# EAGLE design untitled (EAGLE 8.2.1)
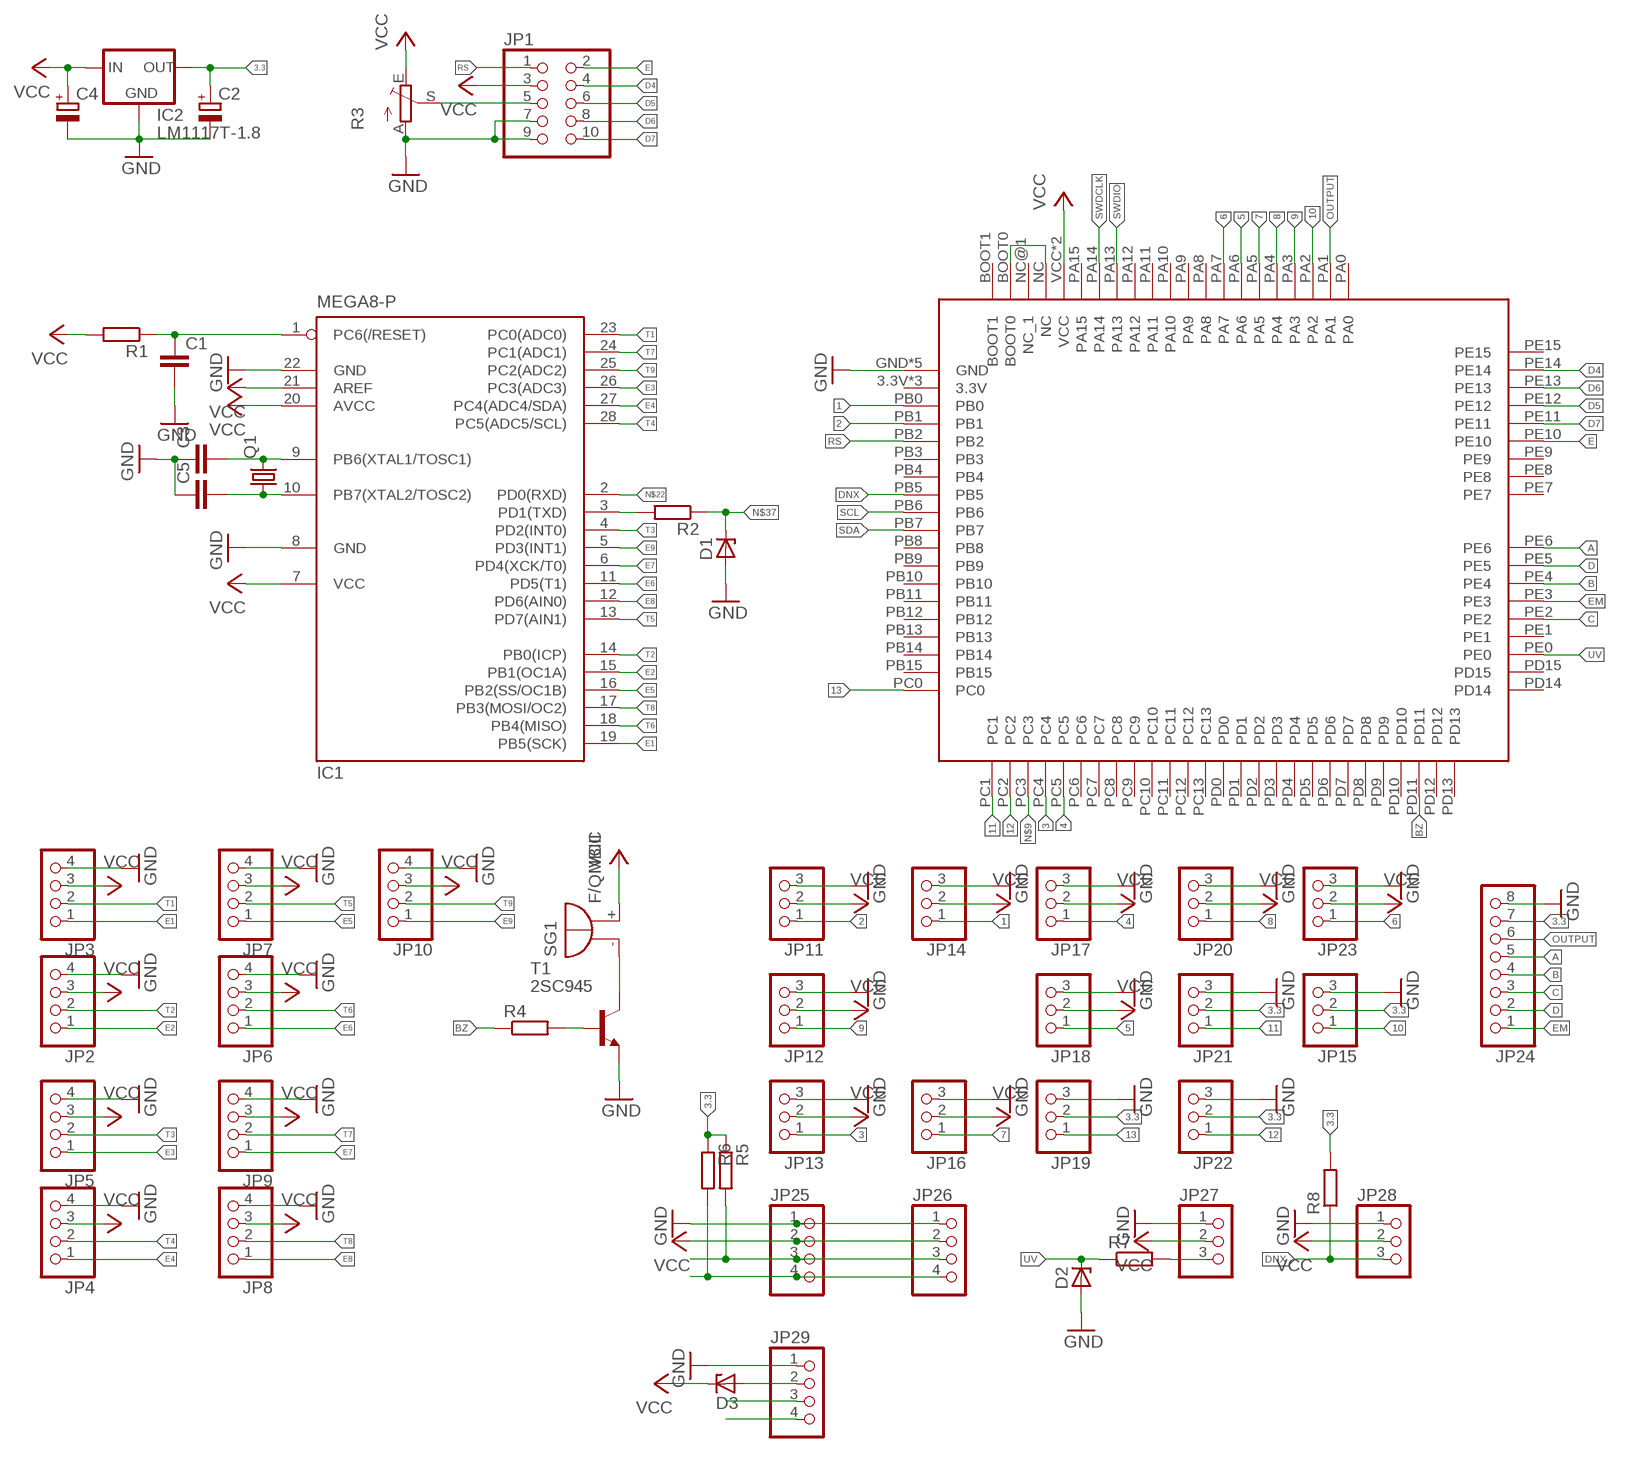
[diagram p0: schematic, sheet 1]

## Parts
C1  C-EU025-025X050  [C025-025X050]
C2  CPOL-EUE2.5-5  [E2,5-5]
C3  C-EU025-025X050  [C025-025X050]
C4  CPOL-EUE2.5-5  [E2,5-5]
C5  C-EU025-025X050  [C025-025X050]
D1  ZENER-DIODEDO34-7  [DO34Z7]
D2  ZENER-DIODEDO34-7  [DO34Z7]
D3  ZENER-DIODEDO34-7  [DO34Z7]
IC1  MEGA8-P  [DIL28-3]
IC2  LM1117T-1.8  [TO220]
JP1  PINHD-2X5  [2X05]
JP2  PINHD-1X4  [1X04]
JP3  PINHD-1X4  [1X04]
JP4  PINHD-1X4  [1X04]
JP5  PINHD-1X4  [1X04]
JP6  PINHD-1X4  [1X04]
JP7  PINHD-1X4  [1X04]
JP8  PINHD-1X4  [1X04]
JP9  PINHD-1X4  [1X04]
JP10  PINHD-1X4  [1X04]
JP11  PINHD-1X3  [1X03]
JP12  PINHD-1X3  [1X03]
JP13  PINHD-1X3  [1X03]
JP14  PINHD-1X3  [1X03]
JP15  PINHD-1X3  [1X03]
JP16  PINHD-1X3  [1X03]
JP17  PINHD-1X3  [1X03]
JP18  PINHD-1X3  [1X03]
JP19  PINHD-1X3  [1X03]
JP20  PINHD-1X3  [1X03]
JP21  PINHD-1X3  [1X03]
JP22  PINHD-1X3  [1X03]
JP23  PINHD-1X3  [1X03]
JP24  PINHD-1X8  [1X08]
JP25  PINHD-1X4  [1X04]
JP26  PINHD-1X4  [1X04]
JP27  PINHD-1X3  [1X03]
JP28  PINHD-1X3  [1X03]
JP29  PINHD-1X4  [1X04]
Q1  CRYSTALHC49U70  [HC49U70]
R1  R-EU_0204/7  [0204/7]
R2  R-EU_0204/7  [0204/7]
R3  TRIM_EU-CA6V  [CA6V]
R4  R-EU_0204/7  [0204/7]
R5  R-EU_0204/7  [0204/7]
R6  R-EU_0204/7  [0204/7]
R7  R-EU_0204/7  [0204/7]
R8  R-EU_0204/7  [0204/7]
SG1  F/QMBIII  [F/QMBIII]
T1  2SC945  [TO92-ECB]
U$1  STM32F4  [STM32F4]

## Nets
1: JP14.1 U$1.PB0
2: JP11.1 U$1.PB1
3: JP13.1 U$1.PC4
3.3: C2.+ IC2.2(OUT) JP15.2 JP19.2 JP21.2 JP22.2 JP24.7 R5.1 R6.1 R8.2
4: JP17.1 U$1.PC5
5: JP18.1 U$1.PA6
6: JP23.1 U$1.PA7
7: JP16.1 U$1.PA5
8: JP20.1 U$1.PA4
9: JP12.1 U$1.PA3
10: JP15.1 U$1.PA2
11: JP21.1 U$1.PC1
12: JP22.1 U$1.PC2
13: JP19.1 U$1.PC0
A: JP24.5 U$1.PE6
B: JP24.4 U$1.PE4
BZ: R4.1 U$1.PD11
C: JP24.3 U$1.PE2
D: JP24.2 U$1.PE5
D4: JP1.4 U$1.PE14
D5: JP1.6 U$1.PE12
D6: JP1.8 U$1.PE13
D7: JP1.10 U$1.PE11
DNX: JP28.3 R8.1 U$1.PB5
E: JP1.2 U$1.PE10
E1: IC1.19(PB5(SCK)) JP3.1
E2: IC1.15(PB1(OC1A)) JP2.1
E3: IC1.26(PC3(ADC3)) JP5.1
E4: IC1.27(PC4(ADC4/SDA)) JP4.1
E5: IC1.16(PB2(SS/OC1B)) JP7.1
E6: IC1.11(PD5(T1)) JP6.1
E7: IC1.6(PD4(XCK/T0)) JP9.1
E8: IC1.12(PD6(AIN0)) JP8.1
E9: IC1.5(PD3(INT1)) JP10.1
EM: JP24.1 U$1.PE3
GND: C1.2 C2.- C3.1 C4.- C5.1 D1.A D2.A IC1.8(GND) IC1.22(GND) IC2.1(GND) JP1.7 JP1.9 JP2.4 JP3.4 JP4.4 JP5.4 JP6.4 JP7.4 JP8.4 JP9.4 JP10.4 JP11.3 JP12.3 JP13.3 JP14.3 JP15.3 JP16.3 JP17.3 JP18.3 JP19.3 JP20.3 JP21.3 JP22.3 JP23.3 JP24.8 JP25.1 JP26.1 JP27.1 JP28.1 JP29.1 R3.A T1.E U$1.GND U$1.GND@1(GND) U$1.GND@2(GND) U$1.GND@3(GND) U$1.GND@5(GND)
N$1: C1.1 IC1.1(PC6(/RESET)) R1.1
N$2: D3.A JP29.2
N$3: C5.2 IC1.10(PB7(XTAL2/TOSC2)) Q1.1
N$4: C3.2 IC1.9(PB6(XTAL1/TOSC1)) Q1.2
N$6: JP27.3 R7.2
N$7: JP1.5 R3.S
N$9: U$1.PC3
N$15: U$1.BOOT0 U$1.NC
N$16: SG1.-(+) T1.C
N$17: R4.2 T1.B
N$22: IC1.2(PD0(RXD))
N$23: IC1.3(PD1(TXD)) R2.2
N$37: D1.C R2.1
OUTPUT: JP24.6 U$1.PA1
RS: JP1.1 U$1.PB2
SCL: JP25.4 JP26.4 R6.2 U$1.PB6
SDA: JP25.3 JP26.3 R5.2 U$1.PB7
SWDCLK: JP29.3 U$1.PA14
SWDIO: JP29.4 U$1.PA13
T1: IC1.23(PC0(ADC0)) JP3.2
T2: IC1.14(PB0(ICP)) JP2.2
T3: IC1.4(PD2(INT0)) JP5.2
T4: IC1.28(PC5(ADC5/SCL)) JP4.2
T5: IC1.13(PD7(AIN1)) JP7.2
T6: IC1.18(PB4(MISO)) JP6.2
T7: IC1.24(PC1(ADC1)) JP9.2
T8: IC1.17(PB3(MOSI/OC2)) JP8.2
T9: IC1.25(PC2(ADC2)) JP10.2
UV: D2.C R7.1 U$1.PE0
VCC: C4.+ D3.C IC1.7(VCC) IC1.20(AVCC) IC1.21(AREF) IC2.3(IN) JP1.3 JP2.3 JP3.3 JP4.3 JP5.3 JP6.3 JP7.3 JP8.3 JP9.3 JP10.3 JP11.2 JP12.2 JP13.2 JP14.2 JP16.2 JP17.2 JP18.2 JP20.2 JP23.2 JP25.2 JP26.2 JP27.2 JP28.2 R1.2 R3.E SG1.+(-) U$1.VCC U$1.VCC@1(VCC)
Unconnected: U$1.3.3V U$1.3.3V@2(3.3V) U$1.3.3V@3(3.3V) U$1.BOOT1 U$1.NC@1(NC_1) U$1.PA0 U$1.PA8 U$1.PA9 U$1.PA10 U$1.PA11 U$1.PA12 U$1.PA15 U$1.PB3 U$1.PB4 U$1.PB8 U$1.PB9 U$1.PB10 U$1.PB11 U$1.PB12 U$1.PB13 U$1.PB14 U$1.PB15 U$1.PC6 U$1.PC7 U$1.PC8 U$1.PC9 U$1.PC10 U$1.PC11 U$1.PC12 U$1.PC13 U$1.PD0 U$1.PD1 U$1.PD2 U$1.PD3 U$1.PD4 U$1.PD5 U$1.PD6 U$1.PD7 U$1.PD8 U$1.PD9 U$1.PD10 U$1.PD12 U$1.PD13 U$1.PD14 U$1.PD15 U$1.PE1 U$1.PE7 U$1.PE8 U$1.PE9 U$1.PE15

## Library data of the parts
C1 C3 C5 = rcl:C-EU: CAPACITOR, European symbol
C2 C4 = rcl:CPOL-EU: POLARIZED CAPACITOR, European symbol
D1-D3 = diode:ZENER-DIODE: Z-Diode
IC1 = atmel:MEGA8-P: MICROCONTROLLER 8 Kbytes FLASH, 1 kbytes SRAM, 512 bytes EEPROM, USART, 4-channel 10 bit ADC, 2-channel 8 bit ADC Pin compatible with Atmega48, ATMega88, ATMega168 Source: avr.lbr; OC_FARNELL: unknown; OC_NEWARK: unknown
IC2 = lm1117:LM1117T-*
JP1 = pinhead:PINHD-2X5: PIN HEADER
JP2-JP10 JP25 JP26 JP29 = pinhead:PINHD-1X4: PIN HEADER
JP11-JP23 JP27 JP28 = pinhead:PINHD-1X3: PIN HEADER
JP24 = pinhead:PINHD-1X8: PIN HEADER
Q1 = crystal:CRYSTAL: CRYSTAL; OC_FARNELL: unknown; OC_NEWARK: unknown
R1 R2 R4-R8 = rcl:R-EU_: RESISTOR, European symbol
R3 = pot:TRIM_EU-: POTENTIOMETER
SG1 = buzzer:F/QMBIII: BUZZER Source: Buerklin; OC_FARNELL: unknown; OC_NEWARK: unknown
T1 = transistor:2SC945: NPN Silicon Epitaxial Planar Transistor Source: SEMTECH ELECTRONICS LTD. ... 2SC945 2.pdf
U$1 = STM32F407-2:STM32F4

## Board
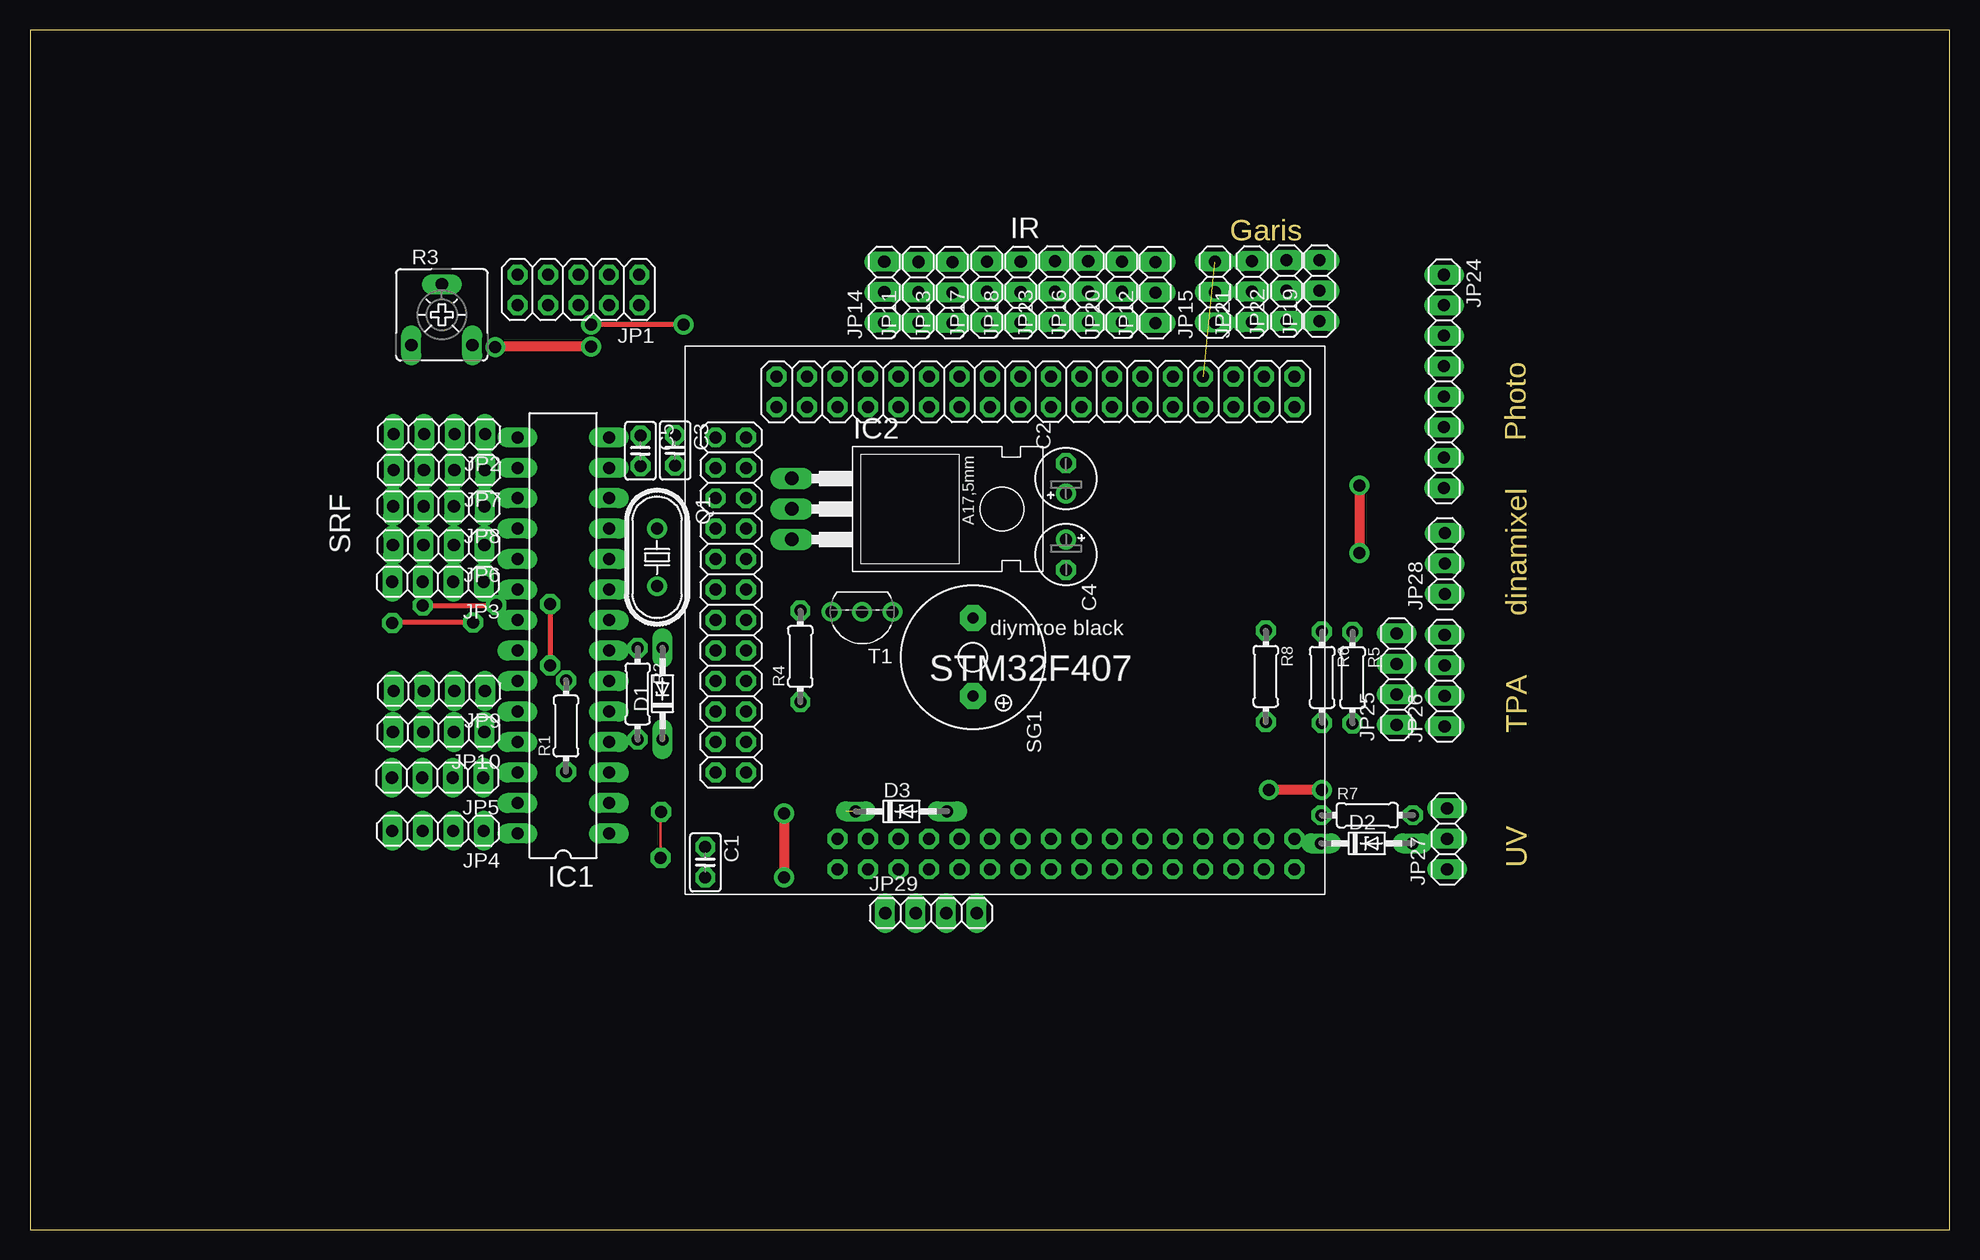
[diagram p1: board, top side]
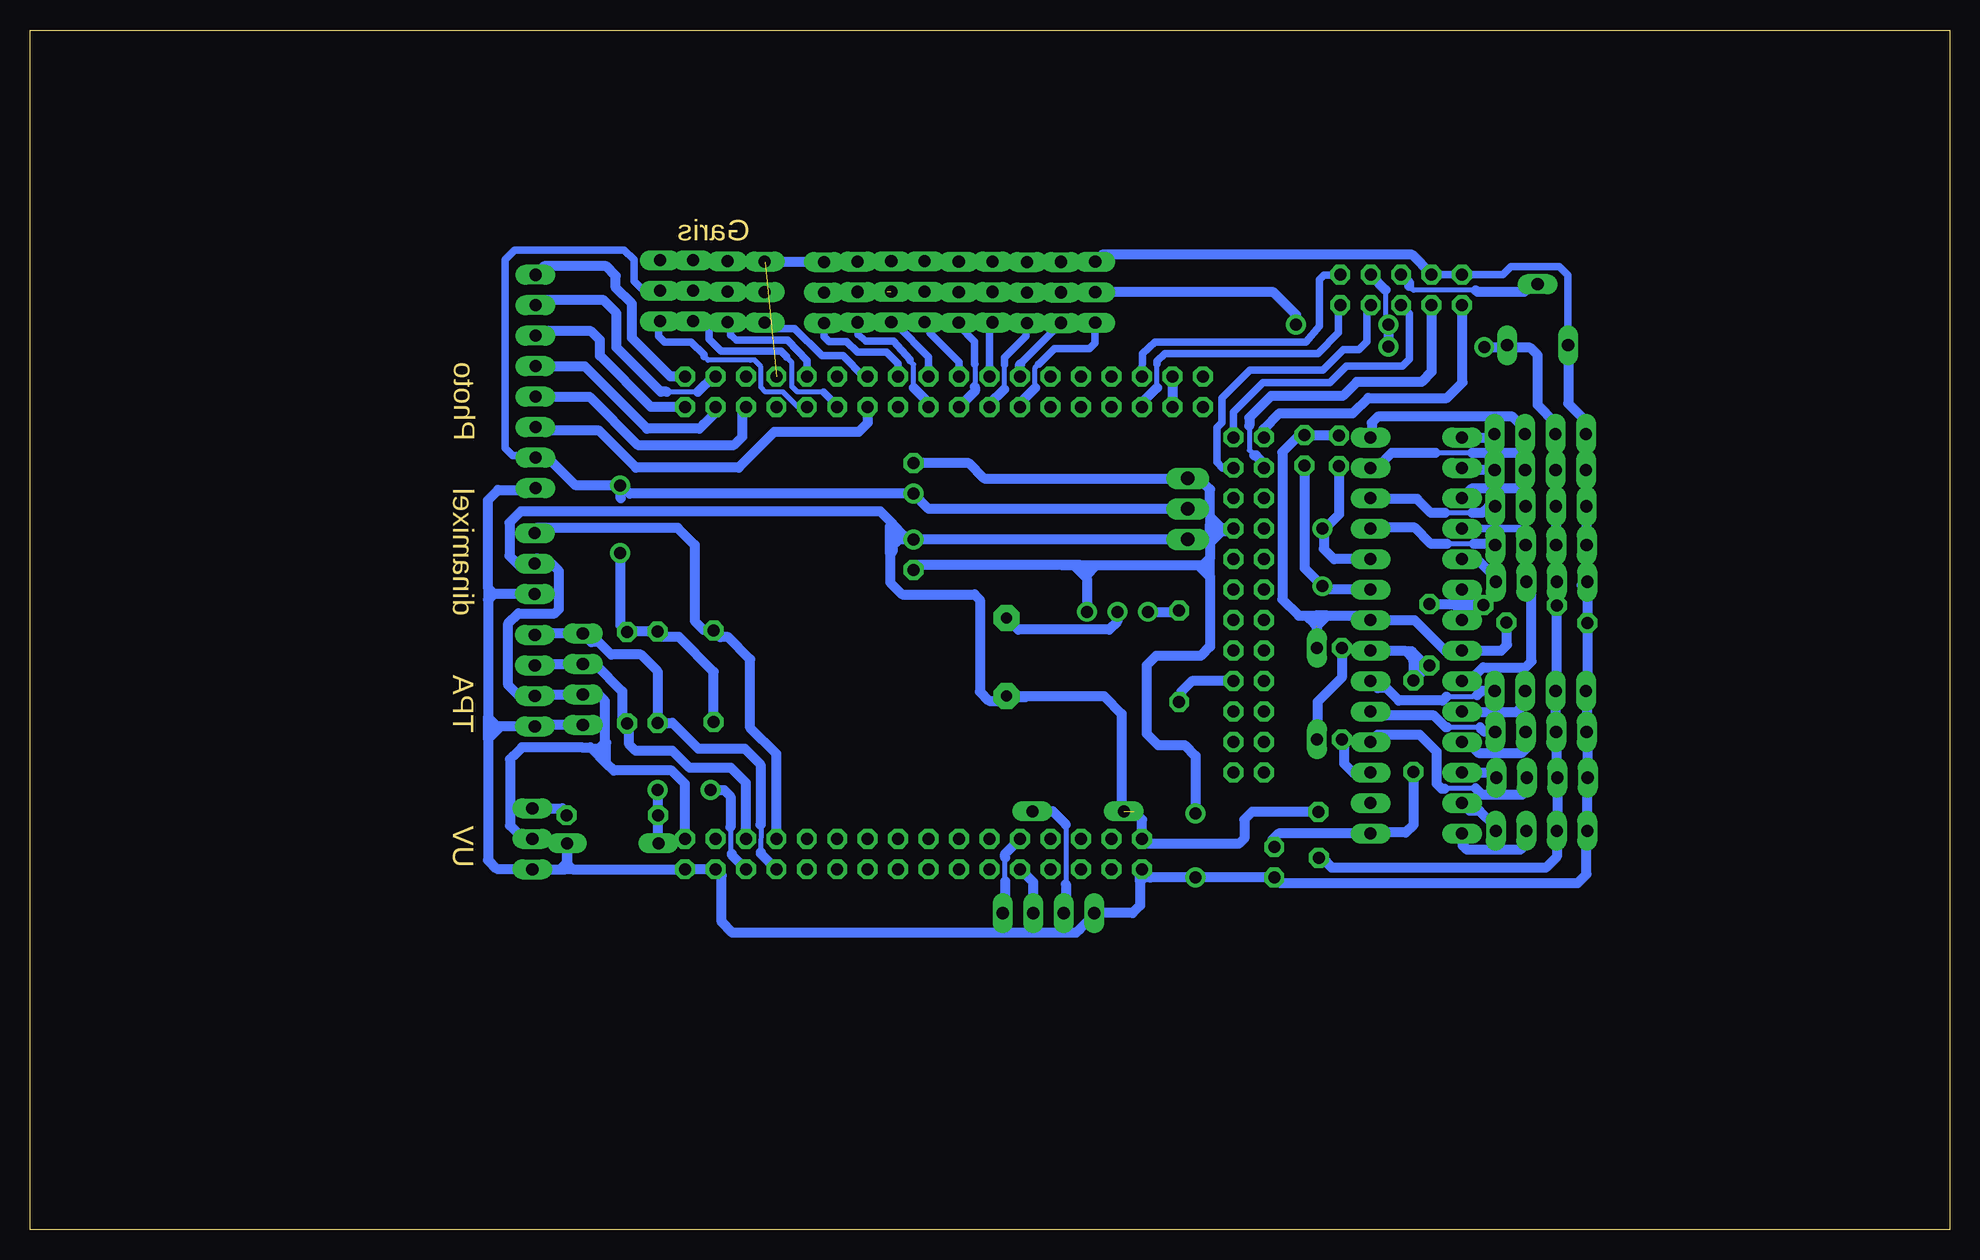
[diagram p2: board, bottom side, seen from below]

Size 160 x 100 mm. Coordinates in mm from the lower left corner, seen from the top.
Outline: 0,0 160,0 160,100 0,100 0,0
Copper layers (1*16): Top 0.035mm / dielectric 1.5mm / Bottom 0.035mm
Design rules "default *": minimum track width 6mil, minimum drill 1mm, track to track 6mil, track to pad 7mil, pad to pad 6mil, via to via 6mil, smd to smd 6mil, copper to edge 40mil, drill to drill 6mil, minimum pad ring 13mil, minimum via ring 13mil, stop-mask expansion 4mil, vias tented up to drill 0mil, thermal gap 10mil

### Footprints (pad centres in the part's own frame; a part is rotated, then mirrored left to right if it is on the bottom)
C025-025X050 = drill 1 octagon: 1 -1.27,0; 2 1.27,0
E2,5-5 = drill 1 pad 1.6: + -1.27,0 | drill 1 pad 1.6 octagon: - 1.27,0
DO34Z7 = drill 1 long: A 3.81,0; C -3.81,0
DIL28-3 = drill 1 long: 1 -16.51,-3.81; 2 -13.97,-3.81; 3 -11.43,-3.81; 4 -8.89,-3.81; 5 -6.35,-3.81; 6 -3.81,-3.81; 7 -1.27,-3.81; 8 1.27,-3.81; 9 3.81,-3.81; 10 6.35,-3.81; 11 8.89,-3.81; 12 11.43,-3.81; 13 13.97,-3.81; 14 16.51,-3.81; 15 16.51,3.81; 16 13.97,3.81; 17 11.43,3.81; 18 8.89,3.81; 19 6.35,3.81; 20 3.81,3.81; 21 1.27,3.81; 22 -1.27,3.81; 23 -3.81,3.81; 24 -6.35,3.81; 25 -8.89,3.81; 26 -11.43,3.81; 27 -13.97,3.81; 28 -16.51,3.81
TO220 = drill 1.118 long: 1 -2.54,-6.35; 2 0,-6.35; 3 2.54,-6.35
2X05 = drill 1 octagon: 1 -5.08,-1.27; 2 -5.08,1.27; 3 -2.54,-1.27; 4 -2.54,1.27; 5 0,-1.27; 6 0,1.27; 7 2.54,-1.27; 8 2.54,1.27; 9 5.08,-1.27; 10 5.08,1.27
1X04 = drill 1.016 long: 1 -3.81,0; 2 -1.27,0; 3 1.27,0; 4 3.81,0
1X03 = drill 1.016 long: 1 -2.54,0; 2 0,0; 3 2.54,0
1X08 = drill 1.016 long: 1 -8.89,0; 2 -6.35,0; 3 -3.81,0; 4 -1.27,0; 5 1.27,0; 6 3.81,0; 7 6.35,0; 8 8.89,0
HC49U70 = drill 1: 1 -2.413,0; 2 2.413,0
0204/7 = drill 1 octagon: 1 -3.81,0; 2 3.81,0
CA6V = drill 1.016 long: A -2.54,-2.54; E 2.54,-2.54; S 0,2.54
F/QMBIII = drill 0.914 pad 2.159 octagon: + 3.251,0; - -3.251,0
TO92-ECB = drill 1: B 2.54,0; C 0,0; E -2.54,0
STM32F4 = drill 1 octagon: 3.3V 13.97,-16.95; 3.3V@2 -29.21,6.35; 3.3V@3 8.89,19.05; BOOT0 -24.13,21.59; BOOT1 -26.67,21.59; GND 16.51,-19.49; GND@1 13.97,-19.49; GND@2 -21.59,-19.49; GND@3 -29.21,8.89; GND@5 8.89,21.59; NC -24.13,19.05; NC@1 -26.67,19.05; PA0 3.81,21.59; PA1 1.27,19.05; PA2 1.27,21.59; PA3 -1.27,21.59; PA4 -3.81,19.05; PA5 -3.81,21.59; PA6 -6.35,19.05; PA7 -6.35,21.59; PA8 -19.05,-19.49; PA9 -16.51,-16.95; PA10 -16.51,-19.49; PA11 -13.97,-16.95; PA12 -13.97,-19.49; PA13 -11.43,-16.95; PA14 -11.43,-19.49; PA15 -8.89,-16.95; PB0 -11.43,19.05; PB1 -11.43,21.59; PB2 -21.59,21.59; PB3 6.35,-16.95; PB4 6.35,-19.49; PB5 8.89,-16.95; PB6 8.89,-19.49; PB7 11.43,-16.95; PB8 -13.97,19.05; PB9 -13.97,21.59; PB10 -29.21,11.43; PB11 -31.75,8.89; PB12 -31.75,6.35; PB13 -29.21,3.81; PB14 -31.75,3.81; PB15 -29.21,1.27; PC0 6.35,19.05; PC1 6.35,21.59; PC2 3.81,19.05; PC3 -1.27,19.05; PC4 -8.89,19.05; PC5 -8.89,21.59; PC6 -31.75,-8.89; PC7 -29.21,-11.43; PC8 -31.75,-11.43; PC9 -19.05,-16.95; PC10 -8.89,-19.49; PC11 -6.35,-16.95; PC12 -6.35,-19.49; PC13 11.43,21.59; PD0 -3.81,-16.95; PD1 -3.81,-19.49; PD2 -1.27,-16.95; PD3 -1.27,-19.49; PD4 1.27,-16.95; PD5 1.27,-19.49; PD6 3.81,-16.95; PD7 3.81,-19.49; PD8 -31.75,1.27; PD9 -29.21,-1.27; PD10 -31.75,-1.27; PD11 -29.21,-3.81; PD12 -31.75,-3.81; PD13 -29.21,-6.35; PD14 -31.75,-6.35; PD15 -29.21,-8.89; PE0 11.43,-19.49; PE1 -16.51,19.05; PE2 16.51,19.05; PE3 16.51,21.59; PE4 13.97,19.05; PE5 13.97,21.59; PE6 11.43,19.05; PE7 -16.51,21.59; PE8 -19.05,19.05; PE9 -19.05,21.59; PE10 -21.59,19.05; PE11 -31.75,16.51; PE12 -29.21,16.51; PE13 -31.75,13.97; PE14 -29.21,13.97; PE15 -31.75,11.43; VCC 16.51,-16.95; VCC@1 -21.59,-16.95

### Placement (x,y rotation side)
C1  56.29,30.61 270 top
C2  86.36,62.61 90 top
C3  53.77,64.95 270 top
C4  86.36,56.26 270 top
C5  50.88,64.92 270 top
D1  52.72,44.67 90 top
D2  111.42,32.19 0 top
D3  72.64,34.86 0 top
IC1  44.45,49.53 90 top
IC2  69.85,60.07 270 top
JP1  45.71,78.34 180 top
JP2  34.12,66.31 180 top
JP3  34.01,54 180 top
JP4  34.01,33.24 180 top
JP5  33.97,37.67 180 top
JP6  34.06,57.05 180 top
JP7  34.11,63.32 180 top
JP8  34.07,60.29 180 top
JP9  34.11,44.9 180 top
JP10  34.06,41.48 180 top
JP11  74.05,78.12 90 top
JP12  93.81,78.11 90 top
JP13  76.89,78.11 90 top
JP14  71.21,78.14 90 top
JP15  98.77,78.15 90 top
JP16  88.21,78.18 90 top
JP17  79.76,78.16 90 top
JP18  82.58,78.14 90 top
JP19  107.48,78.26 90 top
JP20  91.01,78.16 90 top
JP21  101.86,78.18 90 top
JP22  104.74,78.26 90 top
JP23  85.43,78.18 90 top
JP24  117.86,70.7 270 top
JP25  113.91,45.88 90 top
JP26  117.92,45.76 90 top
JP27  118.13,32.57 90 top
JP28  117.93,55.52 90 top
JP29  75.1,26.38 0 top
Q1  52.27,56.04 270 top
R1  44.68,41.97 90 top
R2  50.65,44.66 270 top
R3  34.33,76.26 0 top
R4  64.21,47.78 90 top
R5  110.24,46.01 270 top
R6  107.7,46.04 270 top
R7  111.47,34.54 0 top
R8  103.01,46.12 270 top
SG1  78.6,47.72 270 top
T1  69.37,51.5 180 top
U$1  88.9,49.53 0 top

### Tracks (layer width: path | path; a pad name or v marks a point on that pad's centre or on a via)
1
  Bottom 0.406: 76.22,70.16 76.22,71.86 75.93,72.15
  Bottom 0.61: 75.93,72.15 75.91,72.15 74.62,73.44 71.67,73.44 71.21,73.9 JP14.1
  Bottom 0.813: U$1.PB0 77.47,68.91 76.22,70.16
2
  Bottom 0.61: 77.47,72.14 74.52,75.09 74.52,75.11 JP11.1
  Bottom 0.813: U$1.PB1 77.47,72.14
3
  Bottom 0.406: 78.79,70.06 78.79,72.12
  Bottom 0.61: 78.79,72.12 78.79,72.67 76.99,74.47 76.99,75.47 JP13.1
  Bottom 0.813: U$1.PC4 80.01,68.84 78.79,70.06
3.3  (via drill 1)
  Top 0.813: v110.81,62.04 v110.81,56.4
  Bottom 0.61: JP19.2 108.86,78.26 109.66,79.06 109.66,80.84 110.46,81.64 119.59,81.64 120.39,80.84 120.39,65.13 119.77,64.51 118.02,64.51 JP24.7
  Bottom 0.813: JP15.2 101.83,78.15 JP21.2 104.66,78.18 JP22.2 JP19.2 | IC2.2 85.09,60.07 C2.+ 110.01,61.34 110.52,61.85 110.62,61.85 | 110.62,61.85 v110.81,62.04 110.85,62.08 114.57,62.08 116.84,64.35 JP24.7 | v110.81,56.4 110.81,50.39 R5.1 110.21,49.85 R6.1 107.25,49.4 105.91,49.4 103.01,46.5 R8.2 | 110.77,60.95 110.77,61.7 110.62,61.85
4
  Bottom 0.61: U$1.PC5 80.01,75.37 JP17.1
5
  Bottom 0.406: 81.25,72.13 81.25,70.24
  Bottom 0.61: JP18.1 82.58,75.34 81.27,74.03 81.27,72.15 81.25,72.13
  Bottom 0.813: 81.25,70.24 81.25,69.88 U$1.PA6
6
  Bottom 0.61: U$1.PA7 82.55,72.32 84.98,74.75 84.98,75.19 JP23.1
7
  Bottom 0.61: U$1.PA5 85.09,72.72 87.75,75.38 87.95,75.38 JP16.1
8
  Bottom 0.406: 86.35,70.18 86.35,72.11 86.66,72.42
  Bottom 0.61: 86.66,72.42 86.63,72.54 88.02,74.07 90.31,74.07 90.99,74.61 90.99,75.6 JP20.1
  Bottom 0.813: U$1.PA4 85.09,68.92 86.35,70.18
9
  Bottom 0.61: U$1.PA3 87.63,72.17 88.61,73.15 91.04,73.15 91.93,74.04 93.4,74.04 93.8,74.44 JP12.1
10
  Bottom 0.61: U$1.PA2 90.52,71.12 92.24,72.84 93.99,72.84 96.26,75.11 98.27,75.11 JP15.1
11
  Bottom 0.61: U$1.PC1 95.25,72.45 96.85,74.13 101.12,74.13 101.62,74.55 101.62,75.4 JP21.1
12
  Bottom 0.406: 93.86,69.83 96.04,69.83 96.48,70.27 96.48,72.28 96.93,72.73
  Bottom 0.61: 92.71,68.68 93.86,69.83 | 96.93,72.73 96.93,72.76 97.41,73.22 102.41,73.22 103.41,74.24 103.41,75.36 103.8,75.75 104.71,75.75 JP22.1
  Bottom 0.813: U$1.PC2 92.71,68.68
13
  Bottom 0.406: U$1.PC0 95.99,68.58 97.24,69.83 98.69,69.83 99.08,70.22 99.08,71.92 99.6,72.49 99.94,72.49 99.94,72.47 103.48,72.47 103.83,72.79
  Bottom 0.61: 103.83,72.79 103.83,72.93 104.89,73.99 107.1,73.99 107.6,74.49 107.6,75.6 JP19.1
A
  Bottom 0.813: JP24.5 113.37,69.43 109.34,65.4 101.32,65.4 100.62,66.1 100.62,68.29 U$1.PE6
B
  Bottom 0.813: U$1.PE4 102.87,68.11 103.87,67.11 103.87,67.09 104.19,66.77 108.58,66.77 113.75,71.94 117.83,71.94 JP24.4
BZ
  Bottom 0.813: U$1.PD11 63.15,45.72 64.05,44.82 64.05,44.13 R4.1
C
  Bottom 0.813: U$1.PE2 108.24,68.58 112.5,72.84 112.5,74.15 113.23,74.88 117.49,74.88 JP24.3
D
  Bottom 0.406: U$1.PE5 103.04,71.12 | 104.34,69.82 106.89,69.82 106.92,69.85
  Bottom 0.813: 103.04,71.12 104.34,69.82 | 106.92,69.85 107.42,69.85 111.11,73.54 111.11,76.39 112.18,77.46 117.45,77.46 JP24.2
D4
  Bottom 0.61: U$1.PE14 60.59,63.5 61.07,63.98 61.07,66.85 60.65,67.27 60.65,69.31 58.32,71.64 52.23,71.64 50.53,73.34 49.25,73.34 48.57,74.02 48.57,76.75 JP1.4
D5
  Bottom 0.61: U$1.PE12 59.69,68.16 57.24,70.61 51.63,70.61 50.26,71.98 45.6,71.98 45.01,72.57 45.01,76.37 JP1.6
D6
  Bottom 0.406: 58.37,67.01 58.37,64.96 57.94,64.53
  Bottom 0.813: JP1.8 43.17,71.48 43.99,70.66 49.4,70.66 50.57,69.49 56.56,69.49 58.37,67.68 58.37,67.01 | 57.94,64.53 57.81,64.53 57.36,64.08 57.36,63.71 U$1.PE13
D7
  Bottom 0.813: U$1.PE11 57.15,66.75 55.85,68.05 49.73,68.05 48.45,69.33 41.88,69.33 40.59,70.62 40.59,77.03 JP1.10
DNX
  Bottom 0.813: JP28.3 117.77,58.5 106.01,58.5 104.59,57.08 104.59,50.73 103.88,50.02 103.1,50.02 R8.1 102.46,49.38 101.8,49.38 99.96,47.54 99.96,41.82 97.79,39.65 U$1.PB5
E
  Bottom 0.406: 66.05,70.18 66.05,72.16
  Bottom 0.61: 66.05,72.16 66.05,72.38 65.39,73.04 52.65,73.04 50.93,74.76 50.93,76.93
  Bottom 0.813: U$1.PE10 67.31,68.92 66.05,70.18 | 50.93,76.93 JP1.2
E1
  Bottom 0.813: JP3.1 37.82,54.32 39.11,55.61 40.37,55.61 IC1.19
E2
  Bottom 0.813: IC1.15 38.2,66.04 JP2.1
E3
  Bottom 0.813: IC1.26 38.21,38.1 JP5.1
E4
  Bottom 0.813: JP4.1 37.82,33.55 39.17,34.9 39.98,34.9 IC1.27
E5
  Bottom 0.813: JP7.1 40.46,63.32 IC1.16
E6
  Bottom 0.406: 39.67,57.16 41.89,57.16
  Bottom 0.813: JP6.1 38.35,57.05 38.46,57.16 39.67,57.16 | 41.89,57.16 43.22,57.16 44.57,58.51 48.17,58.51 IC1.11
E7
  Bottom 0.406: 39.38,44.55 39.63,44.55 39.77,44.41 41.9,44.41 41.91,44.4
  Bottom 0.813: JP9.1 39.03,44.9 39.38,44.55 | 41.91,44.4 41.94,44.4 42.24,44.1 45.9,44.1 46.94,45.14 47.68,45.14 IC1.6
E8
  Bottom 0.406: 39.81,59.73 42.06,59.73
  Bottom 0.813: JP8.1 38.4,60.29 38.83,59.86 38.84,59.86 38.96,59.74 39.8,59.74 39.81,59.73 | 42.06,59.73 43.21,59.73 44.39,60.91 48.21,60.91 IC1.12
E9
  Bottom 0.406: 39.13,41.86 41.89,41.86
  Bottom 0.813: JP10.1 38.75,41.48 39.13,41.86 | 41.89,41.86 41.98,41.86 42.96,42.84 47.92,42.84 IC1.5
EM
  Bottom 0.813: U$1.PE3 106.61,71.12 109.82,74.33 109.82,77.17 111.17,78.52 111.17,79.5 111.97,80.3 117.15,80.3 JP24.1
GND  (via drill 1)  (2 unrouted)
  Top 0.406: v36.93,50.61 30.24,50.61
  Top 0.813: 30.24,50.61 v30.2,50.57 | v62.85,34.7 v62.85,29.34
  Bottom 0.61: JP1.7 JP1.9 37.25,79.61 36.57,80.29 32.53,80.29 31.8,79.56 R3.A
  Bottom 0.813: C2.- 81.74,63.88 80.47,62.61 IC2.1 62.55,62.61 61.64,61.7 61.64,59.42 | 61.64,59.42 61.64,58.82 | 61.64,58.82 61.04,58.22 59.89,58.22 U$1.GND@3 | 61.64,57.22 61.64,58.82 | 61.64,57.22 61.64,55.99 | 61.64,55.99 62.24,55.39 62.63,55.39 | 72.45,55.39 62.63,55.39 | 72.45,55.39 85.96,55.39 C4.- | U$1.GND@3 60.44,58.42 61.64,57.22 | U$1.GND@3 60.64,58.42 61.64,59.42 | C5.1 53.74,66.19 C3.1 54.19,66.22 55.61,64.8 55.61,52.54 54.25,51.18 52.87,51.18 | 51.84,51.18 52.87,51.18 | 51.84,51.18 48.64,51.18 IC1.8 44.6,50.8 41.97,48.17 40.73,48.17 IC1.22 37.36,48.26 36.88,48.74 36.88,50.56 v36.93,50.61 | 30.25,44.85 JP10.4 30.16,41.39 JP5.4 30.2,37.63 JP4.4 30.27,33.17 30.27,29.61 31.02,28.86 55.81,28.86 C1.2 v62.85,29.34 66.61,29.34 | 30.25,44.85 JP9.4 | 30.25,44.85 30.2,44.9 v30.2,50.57 JP3.4 30.54,53.66 30.54,53.59 30.65,53.7 30.25,54.1 JP6.4 JP8.4 30.3,60.33 JP7.4 JP2.4 30.59,66.59 30.59,67.67 31.79,68.87 R3.A | 66.61,29.34 U$1.GND@2 67.46,29.89 67.46,28.98 | 51.84,51.18 51.84,51.17 | D1.A 52.72,51.03 52.87,51.18 | 52.72,49.96 52.72,50.29 53.36,50.93 | 52.72,50.21 52.72,50.3 51.84,51.18 | 71.91,54.29 T1.E | 71.91,54.62 71.91,54.85 72.45,55.39 | 71.91,54.29 71.91,54.62 | 71.91,54.62 71.22,55.31 | 73.97,55.39 73.01,55.39 71.91,54.29 | JP19.3 JP22.3 104.66,80.72 JP21.3 101.83,80.69 JP15.3 98.73,80.65 JP12.3 93.76,80.7 JP20.3 90.99,80.72 JP16.3 JP23.3 85.39,80.68 JP18.3 82.56,80.7 JP17.3 79.71,80.65 JP13.3 JP11.3 74.03,80.68 JP14.3 70.62,81.27 44.79,81.27 43.17,79.65 JP1.7 | JP25.1 117.8,42.07 JP26.1 120.78,41.95 | 115.82,30.03 115.36,30.03 | 115.82,30.03 JP27.1 118.18,30.08 121.1,30.08 121.82,30.8 121.82,40.91
  Bottom 0.813: 114.78,30.03 115.36,30.03 | 114.78,30.03 U$1.GND U$1.GND@1 102.35,29.52 102.35,25.63 101.46,24.74 72.8,24.74 72.53,25.01 72.52,25.01 71.29,26.24 JP29.1 68.09,26.38 67.46,27.01 67.46,28.98 | D2.A 115.23,30.16 115.36,30.03 | D2.A 115.23,30.62 115.82,30.03 | D2.A 115.23,30.48 114.78,30.03 | 120.78,41.95 121.07,41.95 121.82,42.7 | 121.82,52.49 121.82,42.7 | 121.82,53.48 121.82,52.49 | 121.82,53.48 121.82,60.81 120.98,61.65 118.02,61.65 JP24.8 | JP28.1 121.33,52.98 | 121.33,52.98 121.82,52.49 | 121.33,52.98 121.33,52.99 121.82,53.48 | 121.82,40.91 121.82,42.7 | 120.78,41.95 121.82,40.91 | 61.64,54.4 61.64,55.99 | 61.64,54.4 61.64,48.6 62.41,47.83 66.13,47.83 66.93,47.03 66.93,41.35 65.96,40.38 63.74,40.38 62.85,39.49 62.85,34.79 62.94,34.7 v62.85,34.7 | 62.63,55.39 61.64,54.4 | 66.61,29.34 67.1,29.34 67.46,28.98
N$1
  Bottom 0.813: R1.1 44.68,33.75 45.34,33.09 48.19,33.09 IC1.1 55.93,33.02 56.42,32.53 56.42,32.01 C1.1
N$2
  Bottom 0.406: 73.66,33.77 73.66,28.8
  Bottom 0.813: D3.A 74.75,34.86 73.66,33.77 | 73.66,28.8 73.66,26.55 JP29.2
N$3
  Bottom 0.813: IC1.10 51.3,55.88 52.16,56.74 52.16,58.34 | Q1.1 52.16,58.34 | C5.2 50.88,59.62 52.16,58.34
N$4
  Bottom 0.813: IC1.9 51.98,53.34 Q1.2 53.77,55.13 C3.2
N$6
  Bottom 0.813: JP27.3 115.63,35.11 R7.2
N$7
  Bottom 0.406: 39.48,78.3 44.68,78.3 45.03,78.65
  Bottom 0.813: R3.S 34.81,78.8 35.46,78.15 39.33,78.15 39.48,78.3 | 45.03,78.65 45.03,78.93 JP1.5
N$15
  Bottom 0.813: U$1.BOOT0 U$1.NC
N$16
  Bottom 0.813: T1.C 69.37,50.69 70.05,50.01 77.64,50.01 SG1.-
N$17
  Bottom 0.813: T1.B 64.3,51.5 R4.2
N$23
  Bottom 0.813: IC1.3 49.72,38.1 50.44,38.82 50.44,40.64 R2.2
N$37
  Bottom 0.813: R2.1 50.65,46.01 52.67,43.99 52.67,40.91 D1.C
OUTPUT
  Bottom 0.813: U$1.PA1 90.17,67.24 90.93,66.48 97.97,66.48 100.93,63.52 109.48,63.52 112.56,66.6 117.57,66.6 JP24.6
RS
  Bottom 0.61: U$1.PB2 67.27,73.01 66.21,73.96 53.63,73.96 52.52,75.33 52.52,79.17 52.13,79.56 50.84,79.56
  Bottom 0.813: 50.84,79.56 JP1.1
SCL
  Bottom 0.406: 99.08,33.73 99.1,31.46
  Bottom 0.813: JP26.4 117.8,49.69 JP25.4 113.19,48.97 112.59,48.97 111.55,47.93 109.07,47.93 107.7,46.56 R6.2 106.44,42.23 104.3,40.09 100.43,40.09 99.11,38.77 99.11,33.76 99.08,33.73 | 99.1,31.46 99.08,31.33 U$1.PB6
SDA
  Bottom 0.813: JP26.3 117.8,47.15 JP25.3 112.91,47.15 110.63,44.87 110.63,42.59 R5.2 110.06,42.02 110.06,40.45 109.52,39.91 106.44,39.91 105.02,38.49 101.57,38.49 100.33,37.25 U$1.PB7
SWDCLK
  Bottom 0.813: JP29.3 76.37,28.94 U$1.PA14
SWDIO
  Bottom 0.406: 78.72,29.05 78.72,31.01
  Bottom 0.813: JP29.4 78.91,26.69 78.69,26.91 78.69,29.02 78.72,29.05 | 78.72,31.01 78.72,31.33 U$1.PA13
T1
  Bottom 0.813: IC1.23 40.03,45.72 38.89,46.86 35.35,46.86 34.85,47.36 34.85,53.57 JP3.2
T2
  Bottom 0.813: JP2.2 35.39,66.73 36.43,67.77 47.65,67.77 48.15,67.27 48.15,66.15 IC1.14
T3
  Bottom 0.406: 39.49,36.78 42.04,36.78 42.07,36.75
  Bottom 0.813: JP5.2 35.24,36.6 35.61,36.23 38.94,36.23 39.49,36.78 | 42.07,36.75 42.33,36.75 42.73,37.15 42.73,39.83 44.15,41.25 47.65,41.25 IC1.4
T4
  Bottom 0.813: JP4.2 35.28,32.16 35.79,31.65 40.21,31.65 40.57,32.01 40.57,32.95 IC1.28
T5
  Bottom 0.406: 39.78,64.73 42.85,64.73
  Bottom 0.813: JP7.2 35.38,64.06 36.05,64.73 37.32,64.73 37.33,64.74 38.51,64.74 38.52,64.73 39.78,64.73 | 42.85,64.73 46.51,64.73 47.66,63.58 48.18,63.58 IC1.13
T6
  Bottom 0.61: IC1.18 35.9,58.42 35.39,57.91 35.39,57.11 JP6.2
T7
  Bottom 0.813: JP9.2 35.38,43.84 36.1,43.12 40.58,43.12 IC1.24
T8
  Bottom 0.813: JP8.2 35.34,61.18 35.92,61.76 39.84,61.76 IC1.17
T9
  Bottom 0.813: IC1.25 40.2,40.64 39.29,39.73 35.64,39.73 35.26,40.11 35.26,41.41 JP10.2
UV  (via drill 1)
  Top 0.813: v107.69,36.63 v103.27,36.63
  Bottom 0.406: 101.61,33.53 101.61,31.43 101.52,31.34
  Bottom 0.813: D2.C 107.63,32.21 R7.1 107.66,36.6 v107.69,36.63 | v103.27,36.63 102.14,36.63 101.61,36.1 101.61,33.53 | 101.52,31.34 101.52,31.23 U$1.PE0
VCC  (via drill 1)  (2 unrouted)
  Top 0.203: v52.58,30.99 52.58,34.79
  Top 0.406: v43.35,52.13 v43.35,47.04 | v32.74,52.02 38.82,52.02 | v54.47,75.43 v46.76,75.43
  Top 0.813: v43.35,47.04 v43.36,47.03 | 38.82,52.02 v38.85,52.05 | 52.58,34.79 v52.62,34.83 | v46.78,73.61 38.82,73.61 v38.79,73.58
  Bottom 0.406: 47.01,78.33 47.01,75.31 46.88,75.31 v46.76,75.43
  Bottom 0.61: 119.74,39.45 119.98,39.21 | 115.01,40.19 114.01,40.19 112.59,40.19 112.07,40.71 112.07,40.64 | 113.23,44.64 112.65,44.64
  Bottom 0.813: IC2.3 C4.+ 87.62,57.53 88.31,56.84 | 40.64,52.09 IC1.21 | 40.64,53.05 40.64,52.09 | 40.64,52.09 41.26,52.09 | 41.26,52.09 43.21,52.09 43.23,52.07 43.29,52.07 v43.35,52.13 | v43.36,47.03 43.65,47.03 44.68,48.06 | 45.33,48.21 44.83,48.21 44.68,48.06 | 45.33,48.21 48.21,48.21 IC1.7 | 44.68,47.32 R1.2 43.43,47.03 v43.36,47.03 | 44.68,47.56 44.68,48.06 | v43.36,47.03 44.39,47.03 44.68,47.32 | 39.64,52.05 v38.85,52.05 39.39,52.05 IC1.21 | 39.64,52.05 40.6,52.05 40.64,52.09 | IC1.20 40.64,53.05 | 40.64,53.05 39.64,52.05 | IC1.21 40.64,51.47 41.26,52.09 | 41.26,52.09 41.26,52.43 40.64,53.05 | 44.68,47.32 44.68,47.56 | 44.68,47.56 45.33,48.21 | v52.58,30.99 52.55,30.96 52.28,30.96 51.48,30.16 33.65,30.16 32.74,31.07 JP4.3 32.7,33.28 JP5.3 32.79,37.76 JP10.3 32.84,41.53 JP9.3 32.74,45 v32.74,52.02 JP3.3 32.79,54.05 JP6.3 JP8.3 32.84,60.33 JP7.3 JP2.3 32.85,67.25 34.33,68.73 34.33,72.89 34.95,73.51 36.66,73.51 R3.E 37.01,73.58 v38.79,73.58 | v52.62,34.83 58.13,34.83 58.79,34.17 58.79,32.6 59.23,32.16 66.89,32.16 U$1.VCC@1 67.31,34.18 68,34.87 | 88.31,56.31 88.31,56.84 | 88.31,56.31 88.31,53.94 87.31,52.94 81.27,52.94 80.83,52.5 80.83,44.85 80.06,44.08 78.99,44.08 SG1.+ | JP12.2 93.76,78.16 JP20.2 90.8,77.95 88.81,77.95 88.58,78.18 JP23.2 85.39,78.14 JP18.2 82.56,78.16 JP17.2 79.71,78.11 JP13.2 JP11.2 74.03,78.14 JP14.2 56.35,78.14 54.47,76.26 v54.47,75.43 | JP26.2 117.8,44.61 JP25.2 113.26,44.61 113.23,44.64 | JP26.2 118.91,44.49 | JP28.2 117.77,55.96 | JP27.2 118.88,32.57 119.98,33.67 119.98,39.21 | U$1.VCC 105.41,37.15 106.52,38.26 111.35,38.26 111.96,38.87 | 88.12,58.87 89.11,59.86 119.09,59.86 120.03,58.92 120.03,56.16 119.06,55.19 118.26,55.19 JP28.2
  Bottom 0.813: 88.12,58.82 88.12,56.5 88.31,56.31 | 88.31,56.84 88.31,58.68 88.12,58.87 | 88.12,58.87 88.12,58.82 | 88.12,58.82 87.13,57.83 | JP26.2 119.24,44.49 120.13,45.38 120.13,50.53 119.29,51.37 116.26,51.37 115.91,51.72 115.91,54.89 116.54,55.52 JP28.2 | 77.04,44.37 78.5,44.37 SG1.+ | 111.96,38.87 111.96,40.6 112.07,40.71 112.07,44.06 112.65,44.64 | 111.96,38.87 113.28,40.19 114.01,40.19 119,40.19 119.74,39.45 | JP1.3 48.25,79.57 47.01,78.33 | v46.76,75.43 46.76,73.63 v46.78,73.61 | SG1.+ 70.48,44.47 69.01,43 69.01,35.04 D3.C

### Text on the board
Dimension: Garis | Photo | dinamixel | TPA | UV
tPlace: IR | SRF